# EAGLE design sht75base (EAGLE 7.3.0)
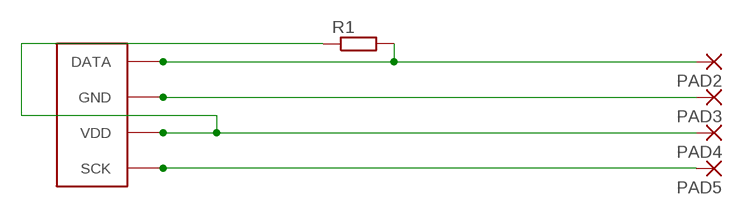
[diagram p0: schematic, sheet 1]

## Parts
PAD2  2,54/1,1  [2,54/1,1]
PAD3  2,54/1,1  [2,54/1,1]
PAD4  2,54/1,1  [2,54/1,1]
PAD5  2,54/1,1  [2,54/1,1]
R1  R-EU_0309/10  [0309/10]
U$2  SHT71  [SHT7X]

## Nets
N$1: PAD4.1(P) R1.1 U$2.2(VDD)
N$2: PAD3.1(P) U$2.3(GND)
N$3: PAD2.1(P) R1.2 U$2.4(DATA)
N$4: PAD5.1(P) U$2.1(SCK)

## Library data of the parts
PAD2-PAD5 = wirepad:2,54/1,1: THROUGH-HOLE PAD
R1 = resistor:R-EU_: RESISTOR, European symbol
U$2 = sht11:SHT71

## Board
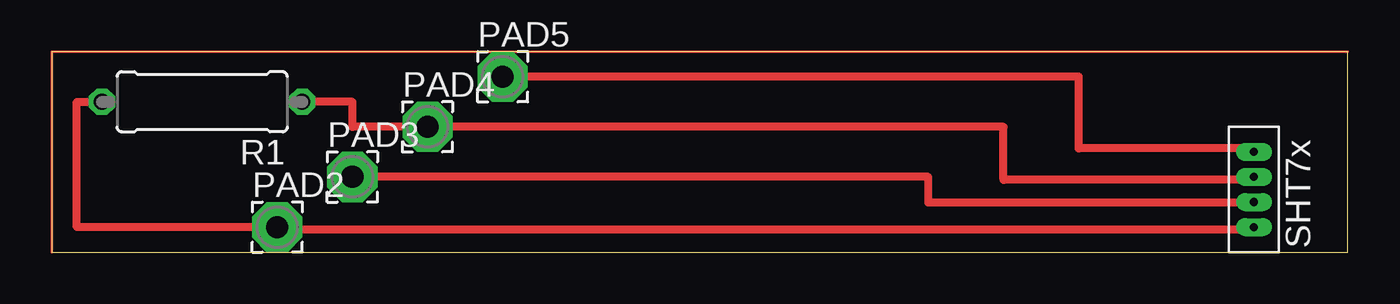
[diagram p1: board, top side]
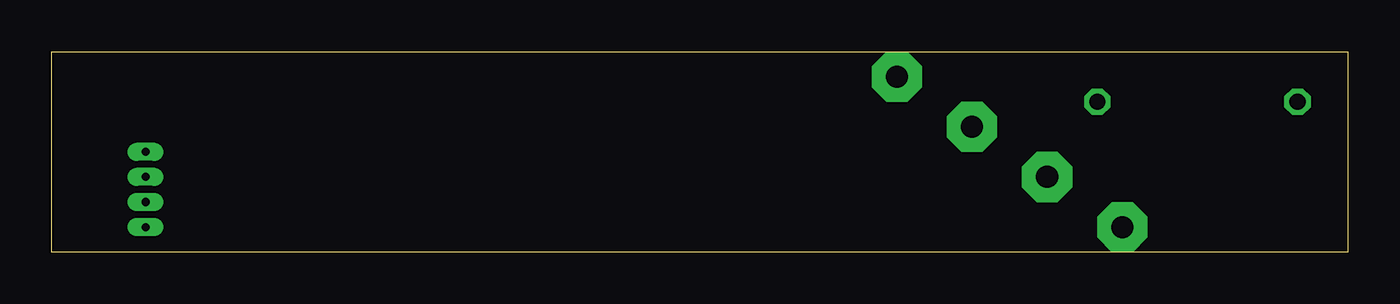
[diagram p2: board, bottom side, seen from below]

Size 65.71 x 10.15 mm. Coordinates in mm from the lower left corner, seen from the top.
Outline: 0,0 65.71,0 65.71,10.15 0,10.15 0,0
Copper layers (1*16): Top 0.035mm / dielectric 1.5mm / Bottom 0.035mm
Design rules "default": minimum track width 10mil, minimum drill 24mil, track to track 8mil, track to pad 8mil, pad to pad 8mil, via to via 8mil, smd to smd 8mil, copper to edge 40mil, drill to drill 8mil, minimum pad ring 10mil, minimum via ring 8mil, stop-mask expansion 4mil, vias tented up to drill 0mil, thermal gap 10mil

### Footprints (pad centres in the part's own frame; a part is rotated, then mirrored left to right if it is on the bottom)
2,54/1,1 = drill 1.118 pad 2.54 octagon: 1 0,0
0309/10 = drill 0.813 octagon: 1 -5.08,0; 2 5.08,0
SHT7X = drill 0.406 pad 0.813 long: 1 1.27,1.27; 2 2.54,1.27; 3 3.81,1.27; 4 5.08,1.27

### Placement (x,y rotation side)
PAD2  11.43,1.27 0 top
PAD3  15.24,3.81 0 top
PAD4  19.05,6.35 0 top
PAD5  22.86,8.89 0 top
R1  7.62,7.62 180 top
U$2  59.69,6.35 270 top

### Tracks (layer width: path | path; a pad name or v marks a point on that pad's centre or on a via)
N$1
  Top 0.254: 60.81,3.66 U$2.2
  Top 0.406: 60.81,3.66 48.26,3.66 48.26,6.35 PAD4.1 15.24,6.35 15.24,7.62 R1.1
N$2
  Top 0.254: 60.81,2.52 U$2.3
  Top 0.406: 60.81,2.52 44.45,2.52 44.45,3.81 PAD3.1
N$3
  Top 0.254: 60.81,1.14 U$2.4
  Top 0.406: 60.81,1.14 11.43,1.14 PAD2.1 1.27,1.27 1.27,7.62 R1.2
N$4
  Top 0.254: 60.81,5.26 U$2.1
  Top 0.406: 60.81,5.26 52.07,5.26 52.07,8.89 PAD5.1
(copper drawn outside any net)
  shapes: Bottom area x1, Top area x2